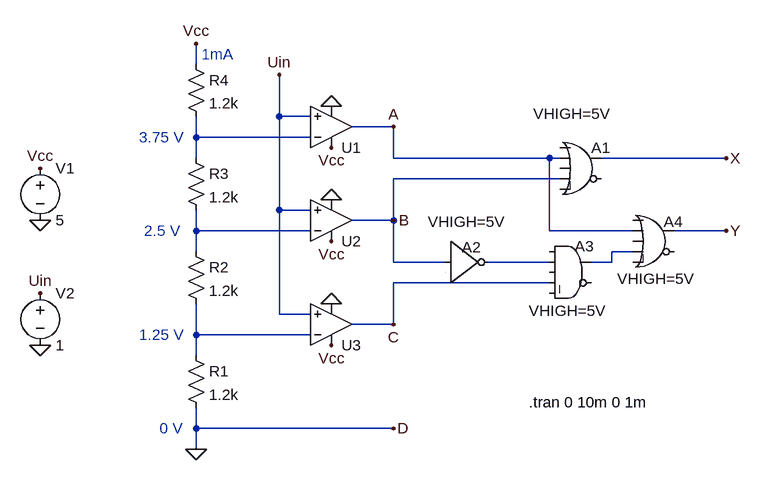
[diagram p0: schematic adc_2bit.asc]
adc_2bit.asc, the LTspice schematic file:
Version 4
SHEET 1 1312 680
WIRE 464 -208 464 -240
WIRE 592 -128 592 -192
WIRE 640 -128 592 -128
WIRE 768 -112 704 -112
WIRE 464 -96 464 -128
WIRE 640 -96 464 -96
WIRE 464 -64 464 -96
WIRE 768 -64 768 -112
WIRE 1008 -64 768 -64
WIRE 1024 -64 1008 -64
WIRE 1280 -64 1088 -64
WIRE 1024 -32 768 -32
WIRE 592 16 592 -128
WIRE 640 16 592 16
WIRE 768 32 768 -32
WIRE 768 32 704 32
WIRE 464 48 464 16
WIRE 640 48 464 48
WIRE 1008 48 1008 -64
WIRE 1136 48 1008 48
WIRE 1280 48 1200 48
WIRE 464 80 464 48
WIRE 1136 80 1104 80
WIRE 768 96 768 32
WIRE 848 96 768 96
WIRE 1008 96 912 96
WIRE 1104 96 1104 80
WIRE 1104 96 1072 96
WIRE 1008 128 768 128
WIRE 592 176 592 16
WIRE 640 176 592 176
WIRE 768 192 768 128
WIRE 768 192 704 192
WIRE 464 208 464 160
WIRE 640 208 464 208
WIRE 464 240 464 208
WIRE 464 352 464 320
WIRE 768 352 464 352
WIRE 464 384 464 352
FLAG 224 224 0
FLAG 224 32 0
FLAG 224 -48 Vcc
FLAG 224 144 Uin
FLAG 464 384 0
FLAG 464 -240 Vcc
FLAG 672 -80 Vcc
FLAG 672 64 Vcc
FLAG 672 224 Vcc
FLAG 672 -144 0
FLAG 672 0 0
FLAG 672 160 0
FLAG 768 -112 A
FLAG 768 32 B
FLAG 768 192 C
FLAG 768 352 D
FLAG 592 -192 Uin
FLAG 1280 -64 X
FLAG 1280 48 Y
SYMBOL voltage 224 -64 R0
WINDOW 123 0 0 Left 0
WINDOW 39 0 0 Left 0
SYMATTR InstName V1
SYMATTR Value 5
SYMBOL voltage 224 128 R0
WINDOW 123 0 0 Left 0
WINDOW 39 0 0 Left 0
SYMATTR InstName V2
SYMATTR Value 1
SYMBOL res 448 224 R0
SYMATTR InstName R1
SYMATTR Value 1.2k
SYMBOL res 448 64 R0
SYMATTR InstName R2
SYMATTR Value 1.2k
SYMBOL res 448 -80 R0
SYMATTR InstName R3
SYMATTR Value 1.2k
SYMBOL res 448 -224 R0
SYMATTR InstName R4
SYMATTR Value 1.2k
SYMBOL OpAmps\\UniversalOpAmp2 672 -112 M180
SYMATTR InstName U1
SYMBOL OpAmps\\UniversalOpAmp2 672 32 M180
SYMATTR InstName U2
SYMBOL OpAmps\\UniversalOpAmp2 672 192 M180
SYMATTR InstName U3
SYMBOL Digital\\or 1056 -112 R0
WINDOW 40 -73 -20 Left 2
WINDOW 0 16 32 Left 2
SYMATTR SpiceLine2 VHIGH=5V
SYMATTR InstName A1
SYMBOL Digital\\inv 848 32 R0
WINDOW 40 -27 2 Left 2
WINDOW 0 25 41 Left 2
SYMATTR SpiceLine2 VHIGH=5V
SYMATTR InstName A2
SYMBOL Digital\\and 1040 48 R0
WINDOW 40 -64 123 Left 2
WINDOW 0 7 24 Left 2
SYMATTR SpiceLine2 VHIGH=5V
SYMATTR InstName A3
SYMBOL Digital\\or 1168 0 R0
WINDOW 40 -56 122 Left 2
WINDOW 0 16 34 Left 2
SYMATTR SpiceLine2 VHIGH=5V
SYMATTR InstName A4
TEXT 976 312 Left 2 !.tran 0 10m 0 1m
TEXT 376 -96 Left 2 ;3.75 V
TEXT 384 48 Left 2 ;2.5 V
TEXT 376 208 Left 2 ;1.25 V
TEXT 472 -224 Left 2 ;1mA
TEXT 408 352 Left 2 ;0 V

The netlist it stands for:
* adc_2bit.asc
V1 Vcc 0 5
V2 Uin 0 1
R1 N005 0 1.2k
R2 N002 N005 1.2k
R3 N001 N002 1.2k
R4 Vcc N001 1.2k
XU1 Uin N001 Vcc 0 A level2 Avol=1Meg GBW=10Meg Slew=10Meg Ilimit=25m Rail=0 Vos=0 En=0 Enk=0 In=0 Ink=0 Rin=500Meg  ; pins In+ In- V+ V- OUT
XU2 Uin N002 Vcc 0 B level2 Avol=1Meg GBW=10Meg Slew=10Meg Ilimit=25m Rail=0 Vos=0 En=0 Enk=0 In=0 Ink=0 Rin=500Meg  ; pins In+ In- V+ V- OUT
XU3 Uin N005 Vcc 0 C level2 Avol=1Meg GBW=10Meg Slew=10Meg Ilimit=25m Rail=0 Vos=0 En=0 Enk=0 In=0 Ink=0 Rin=500Meg  ; pins In+ In- V+ V- OUT
A1 0 A 0 B 0 0 X 0 OR VHIGH=5V
A2 B 0 0 0 0 N004 0 0 BUF VHIGH=5V
A3 0 N004 0 C 0 0 N003 0 AND VHIGH=5V
A4 0 A 0 N003 0 0 Y 0 OR VHIGH=5V
.tran 0 10m 0 1m
* 3.75 V
* 2.5 V
* 1.25 V
* 1mA
* 0 V
.lib UniversalOpAmp2.lib
.backanno
.end